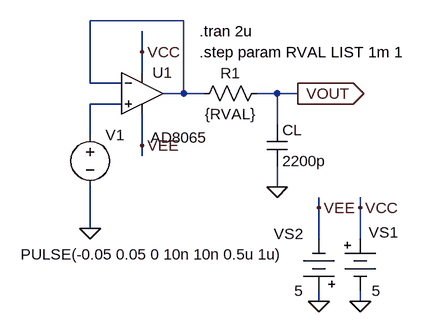
[diagram p0: schematic fig-03-01-40.asc]
fig-03-01-40.asc, the LTspice schematic file:
Version 4
SHEET 1 880 680
WIRE 272 64 128 64
WIRE 208 112 208 80
WIRE 208 144 208 112
WIRE 128 160 128 64
WIRE 176 160 128 160
WIRE 272 176 272 64
WIRE 272 176 240 176
WIRE 304 176 272 176
WIRE 416 176 384 176
WIRE 448 176 416 176
WIRE 176 192 128 192
WIRE 416 224 416 176
WIRE 128 240 128 192
WIRE 208 256 208 208
WIRE 208 272 208 256
WIRE 416 320 416 288
WIRE 480 352 480 336
WIRE 544 352 544 336
WIRE 128 384 128 320
WIRE 480 400 480 352
WIRE 544 400 544 352
WIRE 480 496 480 480
WIRE 544 496 544 480
FLAG 128 384 0
FLAG 448 176 VOUT
IOPIN 448 176 Out
FLAG 480 496 0
FLAG 544 496 0
FLAG 480 352 VEE
FLAG 544 352 VCC
FLAG 208 112 VCC
FLAG 208 256 VEE
FLAG 416 320 0
SYMBOL Misc\\battery 544 384 R0
WINDOW 0 13 6 Left 2
WINDOW 3 18 96 Left 2
WINDOW 123 0 0 Left 0
WINDOW 39 0 0 Left 0
SYMATTR InstName VS1
SYMATTR Value 5
SYMBOL Misc\\battery 480 496 R180
WINDOW 0 24 104 Left 2
WINDOW 3 24 16 Left 2
WINDOW 123 0 0 Left 0
WINDOW 39 0 0 Left 0
SYMATTR InstName VS2
SYMATTR Value 5
SYMBOL res 400 160 R90
WINDOW 0 0 56 VBottom 2
WINDOW 3 32 56 VTop 2
SYMATTR InstName R1
SYMATTR Value {RVAL}
SYMBOL voltage 128 224 R0
WINDOW 3 -107 200 Left 2
WINDOW 123 0 0 Left 0
WINDOW 39 0 0 Left 0
SYMATTR Value PULSE(-0.05 0.05 0 10n 10n 0.5u 1u)
SYMATTR InstName V1
SYMBOL cap 400 224 R0
SYMATTR InstName CL
SYMATTR Value 2200p
SYMBOL Opamps\\AD8065 208 112 R0
WINDOW 3 13 132 Left 2
SYMATTR InstName U1
TEXT 296 80 Left 2 !.tran 2u
TEXT 296 112 Left 2 !.step param RVAL LIST 1m 1

The netlist it stands for:
* fig-03-01-40.asc
VS1 VCC 0 5
VS2 0 VEE 5
R1 VOUT N001 {RVAL}
V1 N002 0 PULSE(-0.05 0.05 0 10n 10n 0.5u 1u)
CL VOUT 0 2200p
XU1 N002 N001 VCC VEE N001 AD8065  ; pins In+ In- V+ V- OUT
.tran 2u
.step param RVAL LIST 1m 1
.backanno
.end